# Altium project 856.PrjPCB
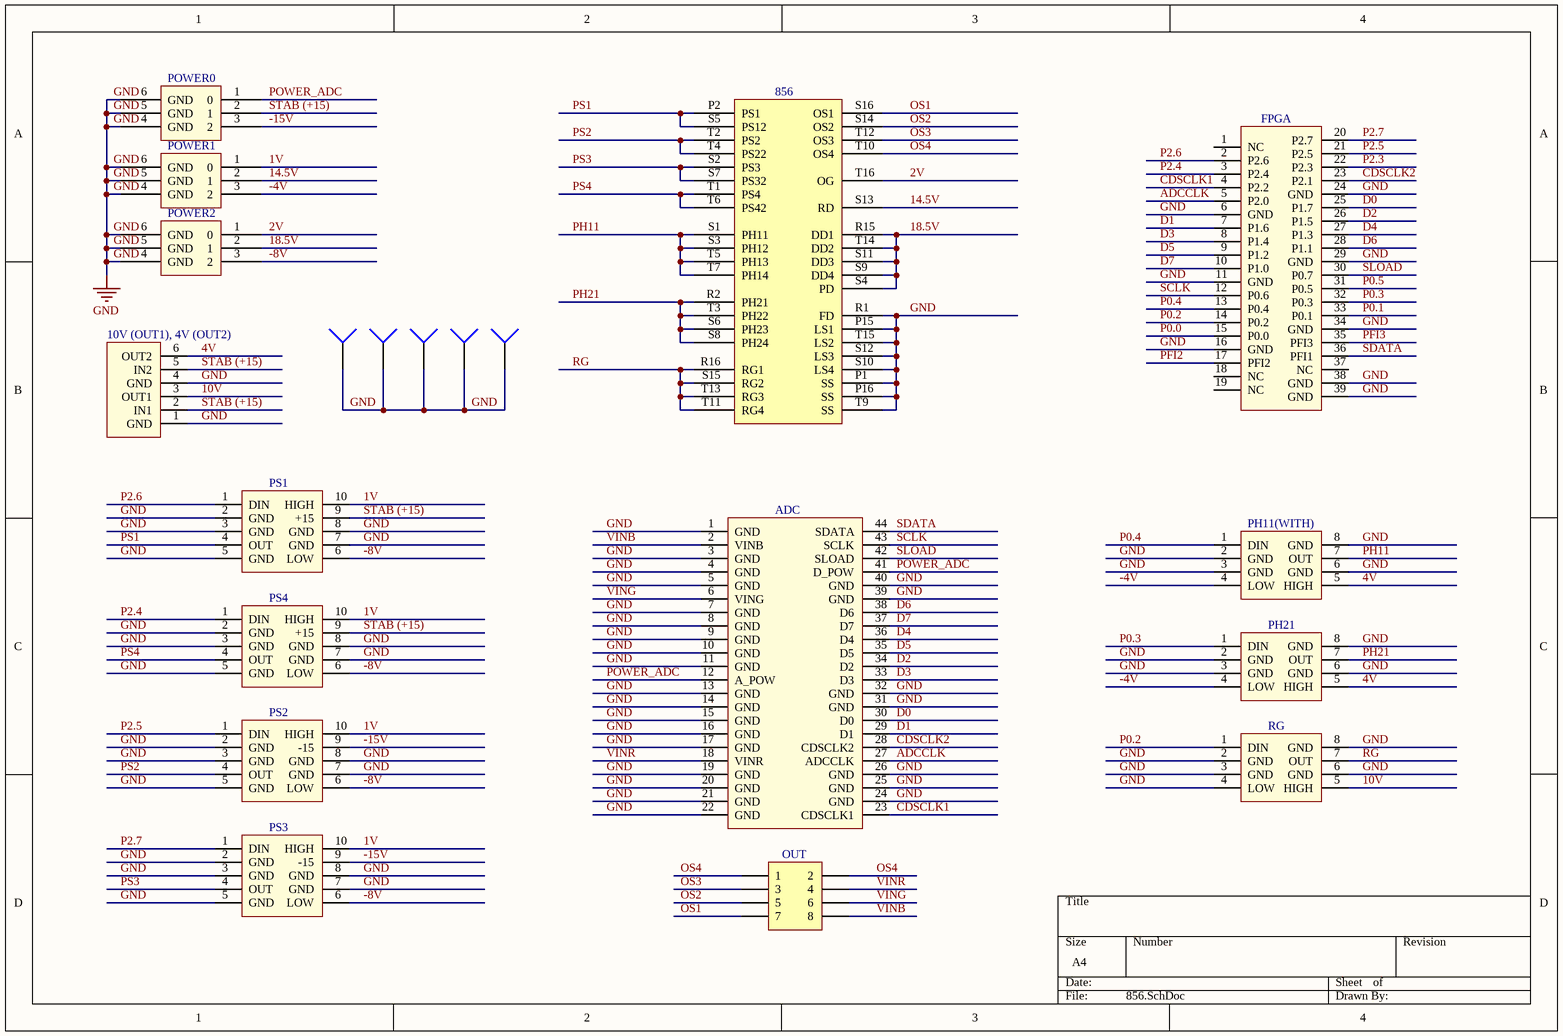
[diagram p0: 856.SchDoc]
1 sheet, 20 parts. Net scope: global (net labels, ports and power ports of the same name join across sheets).
Board file: 856.PcbDoc

## Sheet 856.SchDoc
size A4

### Parts
10V_(OUT1),_4V_(OUT2)  MEZ_POWER  [MEZON_POWER_NEW]  (value not drawn)
856  Б856А-3  [Dzr_place]  (value not drawn)
ADC  MEZON_ADC  [MEZON_ADC]  (value not drawn)
FPGA  CHEAP_CON_37_FEMALE  [CHEAP_CONN_FEMALE]  (value not drawn)
J1  Socket  [PIN1]  (value not drawn)
J2  Socket  [PIN1]  (value not drawn)
J3  Socket  [PIN1]  (value not drawn)
J4  Socket  [PIN1]  (value not drawn)
J5  Socket  [PIN1]  (value not drawn)
OUT  Header 4X2  [HDR2X4]  (value not drawn)
PH11(WITH)  MEZON_H  [MEZON_H]  (value not drawn)
PH21  MEZON_H  [MEZON_H]  (value not drawn)
POWER0  POWER  [POWER]  (value not drawn)
POWER1  POWER  [POWER]  (value not drawn)
POWER2  POWER  [POWER]  (value not drawn)
PS1  MEZON_V+15  [MEZON_V]  (value not drawn)
PS2  MEZON_V  [MEZON_V]  (value not drawn)
PS3  MEZON_V  [MEZON_V]  (value not drawn)
PS4  MEZON_V+15  [MEZON_V]  (value not drawn)
RG  MEZON_H  [MEZON_H]  (value not drawn)

### Nets
GND: 10V_(OUT1),_4V_(OUT2).1(GND) 10V_(OUT1),_4V_(OUT2).4(GND) 856.P1(SS) 856.P15(LS1) 856.P16(SS) 856.R1(FD) 856.S10(LS4) 856.S12(LS3) 856.T9(SS) 856.T15(LS2) ADC.1(GND) ADC.3(GND) ADC.4(GND) ADC.5(GND) ADC.7(GND) ADC.8(GND) ADC.9(GND) ADC.10(GND) ADC.11(GND) ADC.13(GND) ADC.14(GND) ADC.15(GND) ADC.16(GND) ADC.17(GND) ADC.19(GND) ADC.20(GND) ADC.21(GND) ADC.22(GND) ADC.24(GND) ADC.25(GND) ADC.26(GND) ADC.31(GND) ADC.32(GND) ADC.39(GND) ADC.40(GND) FPGA.6(GND) FPGA.11(GND) FPGA.16(GND) FPGA.24(GND) FPGA.29(GND) FPGA.34(GND) FPGA.38(GND) FPGA.39(GND) J1.1 J2.1 J3.1 J4.1 J5.1 PH11(WITH).2(GND) PH11(WITH).3(GND) PH11(WITH).6(GND) PH11(WITH).8(GND) PH21.2(GND) PH21.3(GND) PH21.6(GND) PH21.8(GND) POWER0.4(GND) POWER0.5(GND) POWER0.6(GND) POWER1.4(GND) POWER1.5(GND) POWER1.6(GND) POWER2.4(GND) POWER2.5(GND) POWER2.6(GND) PS1.2(GND) PS1.3(GND) PS1.5(GND) PS1.7(GND) PS1.8(GND) PS2.2(GND) PS2.3(GND) PS2.5(GND) PS2.7(GND) PS2.8(GND) PS3.2(GND) PS3.3(GND) PS3.5(GND) PS3.7(GND) PS3.8(GND) PS4.2(GND) PS4.3(GND) PS4.5(GND) PS4.7(GND) PS4.8(GND) RG.2(GND) RG.3(GND) RG.4(LOW) RG.6(GND) RG.8(GND)
1V: POWER1.1(0) PS1.10(HIGH) PS2.10(HIGH) PS3.10(HIGH) PS4.10(HIGH)
2V: 856.T16(OG) POWER2.1(0)
4V: 10V_(OUT1),_4V_(OUT2).6(OUT2) PH11(WITH).5(HIGH) PH21.5(HIGH)
10V: 10V_(OUT1),_4V_(OUT2).3(OUT1) RG.5(HIGH)
14.5V: 856.S13(RD) POWER1.2(1)
18.5V: 856.R15(DD1) 856.S4(PD) 856.S9(DD4) 856.S11(DD3) 856.T14(DD2) POWER2.2(1)
-4V: PH11(WITH).4(LOW) PH21.4(LOW) POWER1.3(2)
-8V: POWER2.3(2) PS1.6(LOW) PS2.6(LOW) PS3.6(LOW) PS4.6(LOW)
-15V: POWER0.3(2) PS2.9(-15) PS3.9(-15)
ADCCLK: ADC.27(ADCCLK) FPGA.5(P2.0)
CDSCLK1: ADC.23(CDSCLK1) FPGA.4(P2.2)
CDSCLK2: ADC.28(CDSCLK2) FPGA.23(P2.1)
D0: ADC.30(D0) FPGA.25(P1.7)
D1: ADC.29(D1) FPGA.7(P1.6)
D2: ADC.34(D2) FPGA.26(P1.5)
D3: ADC.33(D3) FPGA.8(P1.4)
D4: ADC.36(D4) FPGA.27(P1.3)
D5: ADC.35(D5) FPGA.9(P1.2)
D6: ADC.38(D6) FPGA.28(P1.1)
D7: ADC.37(D7) FPGA.10(P1.0)
OS1: 856.S16(OS1) OUT.7
OS2: 856.S14(OS2) OUT.5
OS3: 856.T12(OS3) OUT.3
OS4: 856.T10(OS4) OUT.1 OUT.2
P0.0: FPGA.15(P0.0)
P0.1: FPGA.33(P0.1)
P0.2: FPGA.14(P0.2) RG.1(DIN)
P0.3: FPGA.32(P0.3) PH21.1(DIN)
P0.4: FPGA.13(P0.4) PH11(WITH).1(DIN)
P0.5: FPGA.31(P0.5)
P2.3: FPGA.22(P2.3)
P2.4: FPGA.3(P2.4) PS4.1(DIN)
P2.5: FPGA.21(P2.5) PS2.1(DIN)
P2.6: FPGA.2(P2.6) PS1.1(DIN)
P2.7: FPGA.20(P2.7) PS3.1(DIN)
PFI2: FPGA.17(PFI2)
PFI3: FPGA.35(PFI3)
PH11: 856.S1(PH11) 856.S3(PH12) 856.T5(PH13) 856.T7(PH14) PH11(WITH).7(OUT)
PH21: 856.R2(PH21) 856.S6(PH23) 856.S8(PH24) 856.T3(PH22) PH21.7(OUT)
POWER_ADC: ADC.12(A_POW) ADC.41(D_POW) POWER0.1(0)
PS1: 856.P2(PS1) 856.S5(PS12) PS1.4(OUT)
PS2: 856.T2(PS2) 856.T4(PS22) PS2.4(OUT)
PS3: 856.S2(PS3) 856.S7(PS32) PS3.4(OUT)
PS4: 856.T1(PS4) 856.T6(PS42) PS4.4(OUT)
RG: 856.R16(RG1) 856.S15(RG2) 856.T11(RG4) 856.T13(RG3) RG.7(OUT)
SCLK: ADC.43(SCLK) FPGA.12(P0.6)
SDATA: ADC.44(SDATA) FPGA.36(PFI1)
SLOAD: ADC.42(SLOAD) FPGA.30(P0.7)
STAB (+15): 10V_(OUT1),_4V_(OUT2).2(IN1) 10V_(OUT1),_4V_(OUT2).5(IN2) POWER0.2(1) PS1.9(+15) PS4.9(+15)
VINB: ADC.2(VINB) OUT.8
VING: ADC.6(VING) OUT.6
VINR: ADC.18(VINR) OUT.4

Not connected (* = marked no-connect by the designer): FPGA 1(NC) 18(NC) 19(NC) 37(NC)

### Library data of the parts
10V_(OUT1),_4V_(OUT2) = MEZON_POWER_NEW
OUT = Header 4X2: Header, 4-Pin, Dual row; LatestRevisionDate: 17-Jul-2002; LatestRevisionNote: Re-released for DXP Platform.; Publisher: Altium Limited
PS1 PS4 = MEZON_V_+15
J1-J5 = Socket: LatestRevisionDate: 17-Jul-2002; LatestRevisionNote: Re-released for DXP Platform.; Publisher: Altium Limited